# Altium schematic sheet Power_Supply.SchDoc
size A4; DrawnBy: Santiago Rodriguez; Revision: V1; SheetNumber: 7; SheetTotal: 9
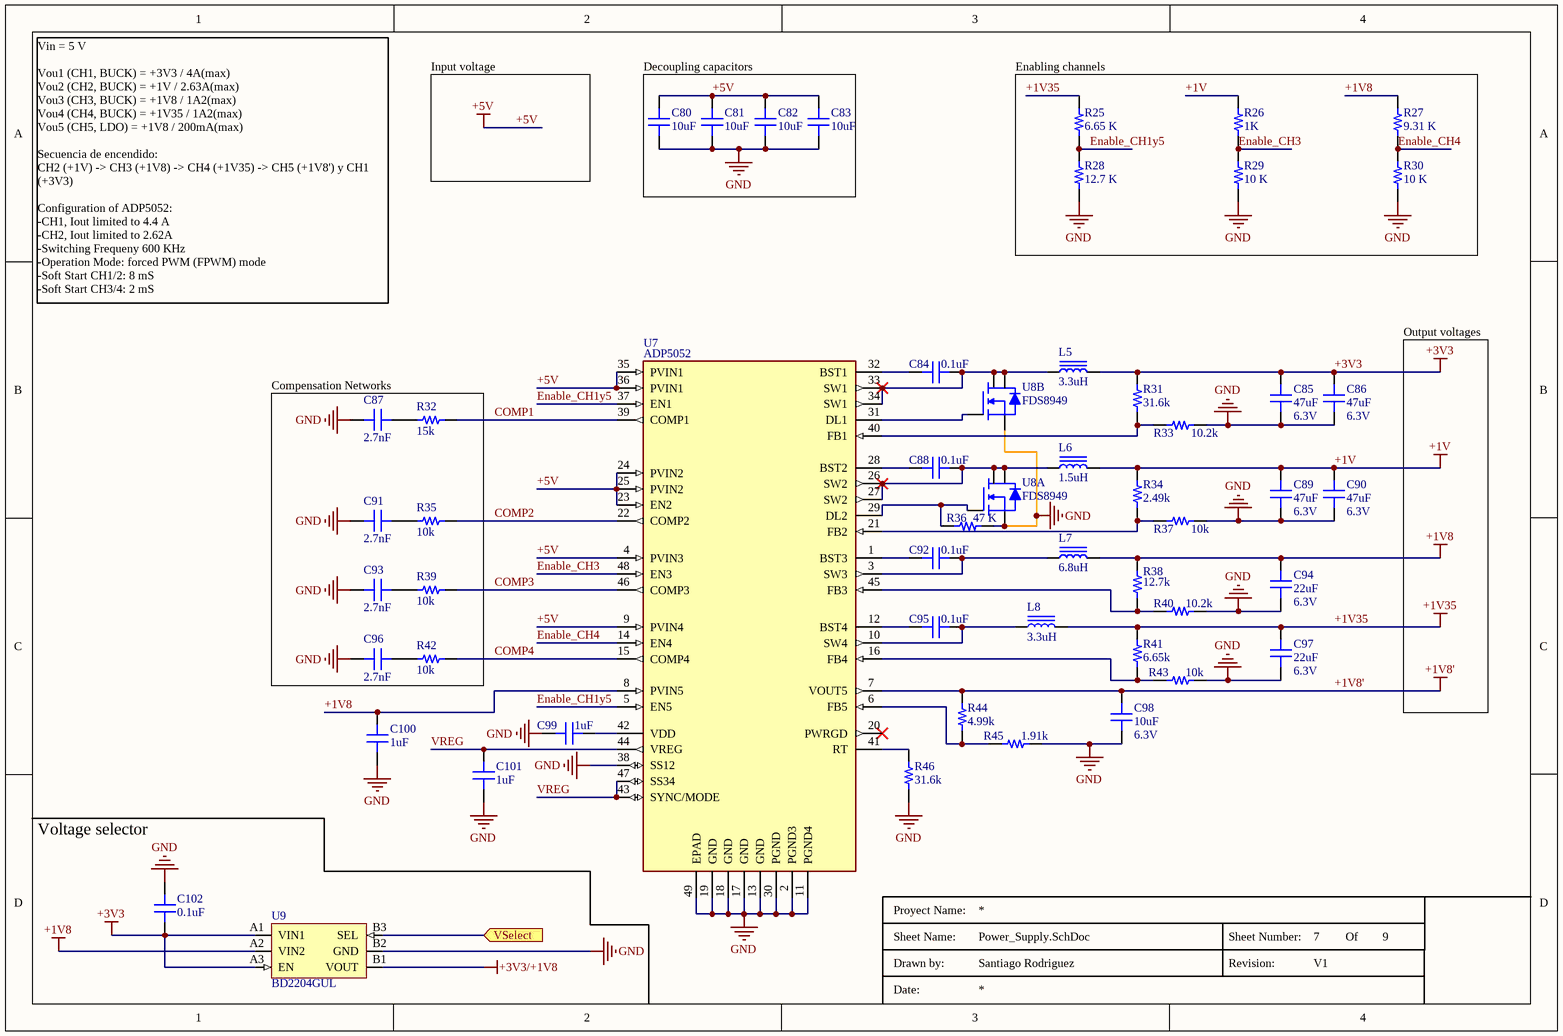
[diagram p0: Power_Supply.SchDoc]

## Parts
C80  10uF  [CAP0805]
C81  10uF  [CAP0805]
C82  10uF  [CAP0805]
C83  10uF  [CAP0805]
C84  0.1uF  [CAP0402]
C85  47uF  Voltage: 6.3V  [CAP0805]
C86  47uF  Voltage: 6.3V  [CAP0805]
C87  2.7nF  [CAP0402]
C88  0.1uF  [CAP0402]
C89  47uF  Voltage: 6.3V  [CAP0805]
C90  47uF  Voltage: 6.3V  [CAP0805]
C91  2.7nF  [CAP0402]
C92  0.1uF  [CAP0402]
C93  2.7nF  [CAP0402]
C94  22uF  Voltage: 6.3V  [CAP0603]
C95  0.1uF  [CAP0402]
C96  2.7nF  [CAP0402]
C97  22uF  Voltage: 6.3V  [CAP0603]
C98  10uF  Voltage: 6.3V  [CAP0603]
C99  1uF  [CAP0402]
C100  1uF  [CAP0402]
C101  1uF  [CAP0402]
C102  0.1uF  [CAP0402]
L5  3.3uH  [IND1616-2.1mm]
L6  1.5uH  [IND1616-2.1mm]
L7  6.8uH  [IND1616-3.1mm]
L8  3.3uH  [IND1616-2.1mm]
R25  6.65 K  [RES0603]
R26  1K  [RES0603]
R27  9.31 K  [RES0603]
R28  12.7 K  [RES0603]
R29  10 K  [RES0603]
R30  10 K  [RES0603]
R31  31.6k  [RES0402]
R32  15k  [RES0402]
R33  10.2k  [RES0402]
R34  2.49k  [RES0402]
R35  10k  [RES0402]
R36  47 K  [RES0603]
R37  10k  [RES0402]
R38  12.7k  [RES0402]
R39  10k  [RES0402]
R40  10.2k  [RES0402]
R41  6.65k  [RES0402]
R42  10k  [RES0402]
R43  10k  [RES0402]
R44  4.99k  [RES0402]
R45  1.91k  [RES0402]
R46  31.6k  [RES0402]
U7  ADP5052  [LFCSP-48]
U8  FDS8949  [SOIC8]  (parts A,B of 2)
U9  BD2204GUL  [UFBGA-6 (VCSP50L1)]

## Blocks framed on the sheet
Decoupling capacitors: C80-C83
Enabling channels: R25-R30
Compensation Networks: C87 C91 C93 C96 R32 R35 R39 R42

## Ports
VSelect (in)

## Nets
+1V: C89.2 C90.2 L6.2 R26.2 R34.2
+1V8: C94.2 C100.2 L7.2 R27.2 R38.2 U7.8(PVIN5) U9.A2(VIN2)
+1V8': C98.2 R44.2 U7.7(VOUT5)
+1V35: C97.2 L8.2 R25.2 R41.2
+3V3: C85.2 C86.2 C102.1 L5.2 R31.2 U9.A1(VIN1) U9.A3(EN)
+3V3/+1V8: U9.B1(VOUT)
+5V: C80.2 C81.2 C82.2 C83.2 U7.4(PVIN3) U7.9(PVIN4) U7.23(EN2) U7.24(PVIN2) U7.25(PVIN2) U7.35(PVIN1) U7.36(PVIN1)
GND: C80.1 C81.1 C82.1 C83.1 C85.1 C86.1 C87.1 C89.1 C90.1 C91.1 C93.1 C94.1 C96.1 C97.1 C98.1 C99.1 C100.1 C101.1 C102.2 R28.1 R29.1 R30.1 R33.2 R36.2 R37.2 R40.2 R43.2 R45.2 R46.1 U7.2(PGND3) U7.11(PGND4) U7.13(GND) U7.17(GND) U7.18(GND) U7.19(GND) U7.30(PGND) U7.38(SS12) U7.49(EPAD) U8.1(S1) U8.3(S2) U9.B2(GND)
COMP1: R32.2 U7.39(COMP1)
COMP2: R35.2 U7.22(COMP2)
COMP3: R39.2 U7.46(COMP3)
COMP4: R42.2 U7.15(COMP4)
Enable_CH1y5: R25.1 R28.2 U7.5(EN5) U7.37(EN1)
Enable_CH3: R26.1 R29.2 U7.48(EN3)
Enable_CH4: R27.1 R30.2 U7.14(EN4)
VREG: C101.2 U7.43(SYNC/MODE) U7.44(VREG) U7.47(SS34)
VSelect: U9.B3(SEL) ; port VSelect
NetC84_1: C84.1 U7.32(BST1)
NetC84_2: C84.2 L5.1 U7.33(SW1) U7.34(SW1) U8.5(D2) U8.6(D2)
NetC87_2: C87.2 R32.1
NetC88_1: C88.1 U7.28(BST2)
NetC88_2: C88.2 L6.1 U7.26(SW2) U7.27(SW2) U8.7(D1) U8.8(D1)
NetC91_2: C91.2 R35.1
NetC92_1: C92.1 U7.1(BST3)
NetC92_2: C92.2 L7.1 U7.3(SW3)
NetC93_2: C93.2 R39.1
NetC95_1: C95.1 U7.12(BST4)
NetC95_2: C95.2 L8.1 U7.10(SW4)
NetC96_2: C96.2 R42.1
NetC99_2: C99.2 U7.42(VDD)
NetR31_1: R31.1 R33.1 U7.40(FB1)
NetR34_1: R34.1 R37.1 U7.21(FB2)
NetR36_1: R36.1 U7.29(DL2) U8.2(G1)
NetR38_1: R38.1 R40.1 U7.45(FB3)
NetR41_1: R41.1 R43.1 U7.16(FB4)
NetR44_1: R44.1 R45.1 U7.6(FB5)
NetR46_2: R46.2 U7.41(RT)
NetU7_31: U7.31(DL1) U8.4(G2)

Not connected (* = marked no-connect by the designer): U7 20(PWRGD)*

## Notes on the sheet
- Input voltage
- Vin = 5 V
  Vou1 (CH1, BUCK) = +3V3 / 4A(max)
  Vou2 (CH2, BUCK) = +1V / 2.63A(max)
  Vou3 (CH3, BUCK) = +1V8 / 1A2(max)
  Vou4 (CH4, BUCK) = +1V35 / 1A2(max)
  Vou5 (CH5, LDO) = +1V8 / 200mA(max)
  Secuencia de encendido:
  CH2 (+1V) -> CH3 (+1V8) -> CH4 (+1V35) -> CH5 (+1V8') y CH1 (+3V3)
  Configuration of ADP5052:
  -CH1, Iout limited to 4.4 A
  -CH2, Iout limited to 2.62A
  -Switching Frequeny 600 KHz
  -Operation Mode: forced PWM (FPWM) mode
  -Soft Start CH1/2: 8 mS
  -Soft Start CH3/4: 2 mS
- Output voltages
- Voltage selector
- Proyect Name:
- Sheet Name:
- Drawn by:
- Revision:
- Sheet Number:
- Of
- Date:

## Library data of the parts
C80-C83 = C0805C106M3PACTU: CAP CER 10UF 25V X5R 0805 10%; Manufacturer: Kemet; ComponentLink1Description: DataSheet; ComponentLink1URL: https://content.kemet.com/datasheets/KEM_C1006_X5R_SMD.pdf; ComponentLink2Description: DigiKey; ComponentLink2URL: https://www.digikey.com/en/products/detail/kemet/C0805C106M3PACTU/5267534; Value: 10uF; Tolerance: 10%; Voltage: 25V; Size: 0805; PartNumber: C0805C106M3PACTU
C84 C88 C92 C95 C102 = C0402C104K4RAC: CAP CER 0.1uF 16V X7R 0402 10%; Manufactuer: Kemet; ComponentLink1Description: DataSheet; ComponentLink1URL: https://content.kemet.com/datasheets/KEM_C1002_X7R_SMD.pdf; ComponentLink2Description: DigiKey; ComponentLink2URL: https://www.digikey.com/en/products/filter/ceramic-capacitors/60?s=N4IgTCBcDaIMIAYAsCxwIzINJIEoEE4QBdAXyA; Value: 0.1uF; Tolerance: 10%; Size: 0402; Voltage: 16V; PartNumber: C0402C104K4RAC
C85 C86 C89 C90 = CL21A476MQYNNNE: CAP CER 47uF 6.3V X5R 0805 20%; Manufacturer: Samsung; ComponentLink1Description: DataSheet; ComponentLink1URL: https://mm.digikey.com/Volume0/opasdata/d220001/medias/docus/658/CL21A476MQYNNNE_Spec.pdf; Size: 0805; ComponentLink2Description: DigiKey; ComponentLink2URL: https://www.digikey.com/en/products/detail/samsung-electro-mechanics/CL21A476MQYNNNE/3887510; Value: 47uF; Tolerance: 20%; PartNumber: CL21A476MQYNNNE
C87 C91 C93 C96 = C0402C272K5RAC: CAP CER 2.7nF 50V X7R 0402 10%; Manufacturer: Kemet; Value: 2.2nF; ComponentLink1Description: DataSheet; ComponentLink1URL: https://content.kemet.com/datasheets/KEM_C1002_X7R_SMD.pdf; ComponentLink2Description: DigiKey; ComponentLink2URL: https://www.digikey.com/en/products/filter/ceramic-capacitors/60?s=N4IgTCBcDaIMIAYAsCxzAdjAaQKwCUBBOEAXQF8g; Tolerance: 10%; PartNumber: C0402C272K5RAC; Voltage: 50V; Size: 0402
C94 C97 = GRM188R60J226MEA0D: CAP CER 22UF 6.3V X5R 0603; ComponentLink1Description: DataSheet; ComponentLink1URL: https://search.murata.co.jp/Ceramy/image/img/A01X/G101/ENG/GRM188R60J226MEA0-01.pdf; Size: 0603; ComponentLink2Description: DigiKey; ComponentLink2URL: https://www.digikey.com/en/products/detail/murata-electronics/GRM188R60J226MEA0D/4280542
C98 = C0603C106M9PAC7867: CAP CER 10UF 6.3V X5R 0603; ComponentLink1Description: DataSheet; ComponentLink1URL: https://content.kemet.com/datasheets/KEM_C1006_X5R_SMD.pdf; Size: 0603; ComponentLink2Description: DigiKey; ComponentLink2URL: https://www.digikey.com/en/products/detail/kemet/C0603C106M9PAC7867/1950664
C99-C101 = C0402C105K4RAC: CAP CER 1uF 16V X7R 0402 10%; Manufacturer: Kemet; ComponentLink1Description: DataSheet; ComponentLink1URL: https://content.kemet.com/datasheets/KEM_C1002_X7R_SMD.pdf; Size: 0402; ComponentLink2Description: DigiKey; ComponentLink2URL: https://www.digikey.com/en/products/detail/kemet/C0402C105K4RAC7867/22058709?s=N4IgTCBcDaIMIAYAsCxwIwIKwGkkCUBBOEAXQF8g; Value: 1uF; Tolerance: 10%; Voltage: 16V; PartNumber: C0402C105K4RAC
L5 L8 = XFL4020-332: FIXED IND 3.3UH 5.2A 38.3MOHM SM; ComponentLink1Description: DigiKey; ComponentLink1URL: https://www.digikey.com/en/products/detail/coilcraft/XFL4020-332MEC/21381630?s=N4IgTCBcDaIBoDEAyAWADGNBaAzDiAugL5A; ComponentLink2Description: DataSheet; ComponentLink2URL: https://www.coilcraft.com/getmedia/50632d43-da1b-4cdb-8ab4-3029cab51df3/xfl4020.pdf; Size: 1616
L6 = XFL4020-152: FIXED IND 1.5UH 9.1A 15.8MOHM SM; ComponentLink1Description: DigiKey; ComponentLink1URL: https://www.digikey.at/en/products/detail/coilcraft/XFL4020-152MEC/21387736; ComponentLink2Description: DataSheet; ComponentLink2URL: https://www.coilcraft.com/getmedia/50632d43-da1b-4cdb-8ab4-3029cab51df3/xfl4020.pdf; Size: 1616
L7 = XAL4030-682MEC: FIXED IND 6.8UH 3.9A 74.1MOHM SM; ComponentLink1Description: DigiKey; ComponentLink1URL: https://www.digikey.com/en/products/detail/coilcraft/XAL4030-682MEC/21381592; ComponentLink2Description: DataSheet; ComponentLink2URL: https://www.coilcraft.com/en-us/files/datasheet/XAL40xx; Size: 1616
R25 = CRCW06036K65FKEA: RES SMD 6.65K OHM 1% 1/10W 0603; ComponentLink1Description: DataSheet; ComponentLink1URL: https://www.vishay.com/docs/20035/dcrcwe3.pdf; Size: 0603; ComponentLink2Description: DigiKey; ComponentLink2URL: https://www.digikey.com/en/products/detail/vishay-dale/CRCW06036K65FKEA/1174762
R26 = CRCW06031K00FKEA: RES SMD 1K OHM 1% 1/10W 0603; ComponentLink1Description: DigiKey; ComponentLink1URL: https://www.digikey.com/es/products/detail/vishay-dale/CRCW06031K00FKEA/1174668; ComponentLink2Description: DataSheet; ComponentLink2URL: https://www.vishay.com/docs/20035/dcrcwe3.pdf; Size: 0603; Value: 1K
R27 = CRCW06039K31FKEA: RES SMD 9.31K OHM 1% 1/10W 0603; ComponentLink1Description: DataSheet; ComponentLink1URL: https://www.vishay.com/docs/20035/dcrcwe3.pdf; Size: 0603; ComponentLink2Description: DigiKey; ComponentLink2URL: https://www.digikey.com/es/products/detail/vishay-dale/CRCW06039K31FKEA/1174779; Value: 9.31k
R28 = CRCW060312K7FKEA: RES SMD 12.7K OHM 1% 1/10W 0603; ComponentLink1Description: DataSheet; ComponentLink1URL: https://www.vishay.com/docs/20035/dcrcwe3.pdf; Size: 0603; ComponentLink2Description: DigiKey; ComponentLink2URL: https://www.digikey.com/en/products/detail/vishay-dale/CRCW060312K7FKEA/1174793
R29 R30 = CRCW060310K0FKEA: RES SMD 10K OHM 1% 1/10W 0603; ComponentLink1Description: DataSheet; ComponentLink1URL: https://www.vishay.com/docs/20035/dcrcwe3.pdf; Size: 0603; ComponentLink2Description: DigiKey; ComponentLink2URL: https://www.digikey.com/en/products/detail/vishay-dale/CRCW060310K0FKEA/1174782
R31 R46 = CRCW040231K6FK: RES SMD 31.6K OHM 1% 0.063W 0402; Manufacturer: Vishay; ComponentLink1Description: DataSheet; ComponentLink1URL: https://www.vishay.com/docs/20035/dcrcwe3.pdf; Size: 0402; ComponentLink2Description: DigiKey; ComponentLink2URL: https://www.digikey.com/en/products/filter/chip-resistor-surface-mount/52?s=N4IgTCBcDaIMICU4HUAMAWVYDMBGA0gGwBi%20IAugL5A; Power: 0.063W; Tolerance: 1%; Value: 31.6k; PartNumber: CRCW040231K6FK
R32 = CRCW040215K0FK: RES SMD 15K OHM 1% 0.063W 0402; Manufacturer: Vishay; ComponentLink1Description: DataSheet; ComponentLink1URL: https://www.vishay.com/docs/20035/dcrcwe3.pdf; Size: 0402; ComponentLink2Description: DigiKey; ComponentLink2URL: https://www.digikey.com/en/products/filter/chip-resistor-surface-mount/52?s=N4IgTCBcDaIMICU4HUAMAWVYCMBWA0qgGL4gC6AvkA; Power: 0.063W; Tolerance: 1%; PartNumber: CRCW040215K0FK; Value: 15k
R33 R40 = CRCW040210K2FK: RES SMD 10.2K OHM 1% 0.063W 0402; Manufacturer: Vishay; ComponentLink1Description: DataSheet; ComponentLink1URL: https://www.vishay.com/docs/20035/dcrcwe3.pdf; Size: 0402; ComponentLink2Description: DigiKey; ComponentLink2URL: https://www.digikey.com/en/products/filter/chip-resistor-surface-mount/52?s=N4IgTCBcDaIMICU4HUAMAWVYCMqDSYAYniALoC%20QA; Value: 10.2k; Power: 0.063W; Tolerance: 1%; PartNumber: CRCW040210K2FK
R34 = CRCW04022K49FK: RES SMD 2.49K OHM 1% 0.063W 0402; Manufacturer: Vishay; ComponentLink1Description: DataSheet; ComponentLink1URL: https://www.vishay.com/docs/20035/dcrcwe3.pdf; Size: 0402; ComponentLink2Description: DigiKey; ComponentLink2URL: https://www.digikey.com/en/products/filter/chip-resistor-surface-mount/52?s=N4IgTCBcDaIMICU4HUAMAWVYwGl0E4AxHEAXQF8g; Value: 2.49k; Tolerance: 1%; Power: 0.063W; PartNumber: CRCW04022K49FK
R35 R37 R39 R42 R43 = CRCW040210K0FK: RES SMD 10K OHM 1% 0.063W 0402; Manufacturer: Vishay; ComponentLink1Description: DataSheet; ComponentLink1URL: https://www.vishay.com/docs/20035/dcrcwe3.pdf; Size: 0402; ComponentLink2Description: DigiKey; ComponentLink2URL: https://www.digikey.com/en/products/filter/chip-resistor-surface-mount/52?s=N4IgTCBcDaIMICU4HUAMAWVYCMqDSqAYniALoC%20QA; Value: 10k; Tolerance: 1%; PartNumber: CRCW040210K0FK; Power: 0.063W
R36 = CRCW060347K0FKEA: RES SMD 47K OHM 1% 1/10W 0603; ComponentLink1Description: DataSheet; ComponentLink1URL: https://www.vishay.com/docs/20035/dcrcwe3.pdf; Size: 0603; ComponentLink2Description: DigiKey; ComponentLink2URL: https://www.digikey.com/es/products/detail/vishay-dale/CRCW060347K0FKEA/1174858; Value: 47 K
R38 = CRCW040212K7FK: RES SMD 12.7K OHM 1% 0.063W 0402; Manufacturer: Vishay; PartNumber: CRCW060312K7FK; ComponentLink1Description: DataSheet; ComponentLink1URL: https://www.vishay.com/docs/20035/dcrcwe3.pdf; Size: 0402; ComponentLink2Description: DigiKey; ComponentLink2URL: https://www.digikey.com/en/products/filter/chip-resistor-surface-mount/52?s=N4IgTCBcDaIMICU4HUAMAWVYCMYDSA7AGJ4gC6AvkA; Value: 12.7k; Tolerance: 1%; Power: 0.063W
R41 = CRCW04026K65FK: RES SMD 6.65K OHM 1% 0.063W 0402; Manufacturer: Vishay; ComponentLink1Description: DataSheet; ComponentLink1URL: https://www.vishay.com/docs/20035/dcrcwe3.pdf; ComponentLink2Description: DigiKey; ComponentLink2URL: https://www.digikey.com/en/products/filter/chip-resistor-surface-mount/52?s=N4IgTCBcDaIMICU4HUAMAWVYBsBpbArAGK4gC6AvkA; Tolerance: 1%; Power: 0.063W; PartNumber: CRCW04026K65FK; Value: 6.65k; Size: 0402
R44 = CRCW04024K99FK: RES SMD 4.99K OHM 1% 0.063W 0402; Manufacturer: Vishay; ComponentLink1Description: DataSheet; ComponentLink1URL: https://www.vishay.com/docs/20035/dcrcwe3.pdf; Size: 0402; ComponentLink2Description: DigiKey; ComponentLink2URL: https://www.digikey.com/en/products/filter/chip-resistor-surface-mount/52?s=N4IgTCBcDaIMICU4HUAMAWVZ0GkCceAYjiALoC%20QA; Value: 4.99k; Tolerance: 1%; Power: 0.063W; PartNumber: CRCW04024K99FK
R45 = CRCW04021K91FK: RES SMD 1.91K OHM 1% 0.063W 0402; Manufacturer: Vishay; ComponentLink1Description: DataSheet; ComponentLink1URL: https://www.vishay.com/docs/20035/dcrcwe3.pdf; Size: 0402; ComponentLink2Description: Digikey; ComponentLink2URL: https://www.digikey.com/en/products/filter/chip-resistor-surface-mount/52?s=N4IgTCBcDaIMICU4HUAMAWVYCMBpAnNgGK4gC6AvkA; Value: 1.91k; Tolerance: 1%; Power: 0.063W; PartNumber: CRCW04021K91FK
U7 = ADP5052: 5-Channel Integrated Power Solution with Quad / Buck Regulators and 200 mA LDO Regulator; ComponentLink1Description: DataSheet; ComponentLink1URL: https://www.analog.com/media/en/technical-documentation/data-sheets/adp5052.pdf
U8 = FDS8949: MOSFET 2N-CH 40V 6A 8SOIC
U9 = BD2204GUL: Power Supply Selector Switch IC for SD Cards; Manufacturer: ROHM; PartNumber: BD2204GUL; Package: UFBGA-6; ComponentLink1Description: Productrpage; ComponentLink1URL: https://www.rohm.com/products/power-management/power-management-switch-ics/load-switch-ics/bd2204gul-product; ComponentLink2Description: DataSheet; ComponentLink2URL: https://fscdn.rohm.com/en/products/databook/datasheet/ic/power/power_switch/bd2204gul-e.pdf; ComponentLink3Description: DigiKey; ComponentLink3URL: https://www.digikey.com/en/products/detail/rohm-semiconductor/BD2204GUL-E2/5210337